# Altium schematic sheet SIM_slots_2.SchDoc
size A3; SheetNumber: 1; SheetTotal: 2
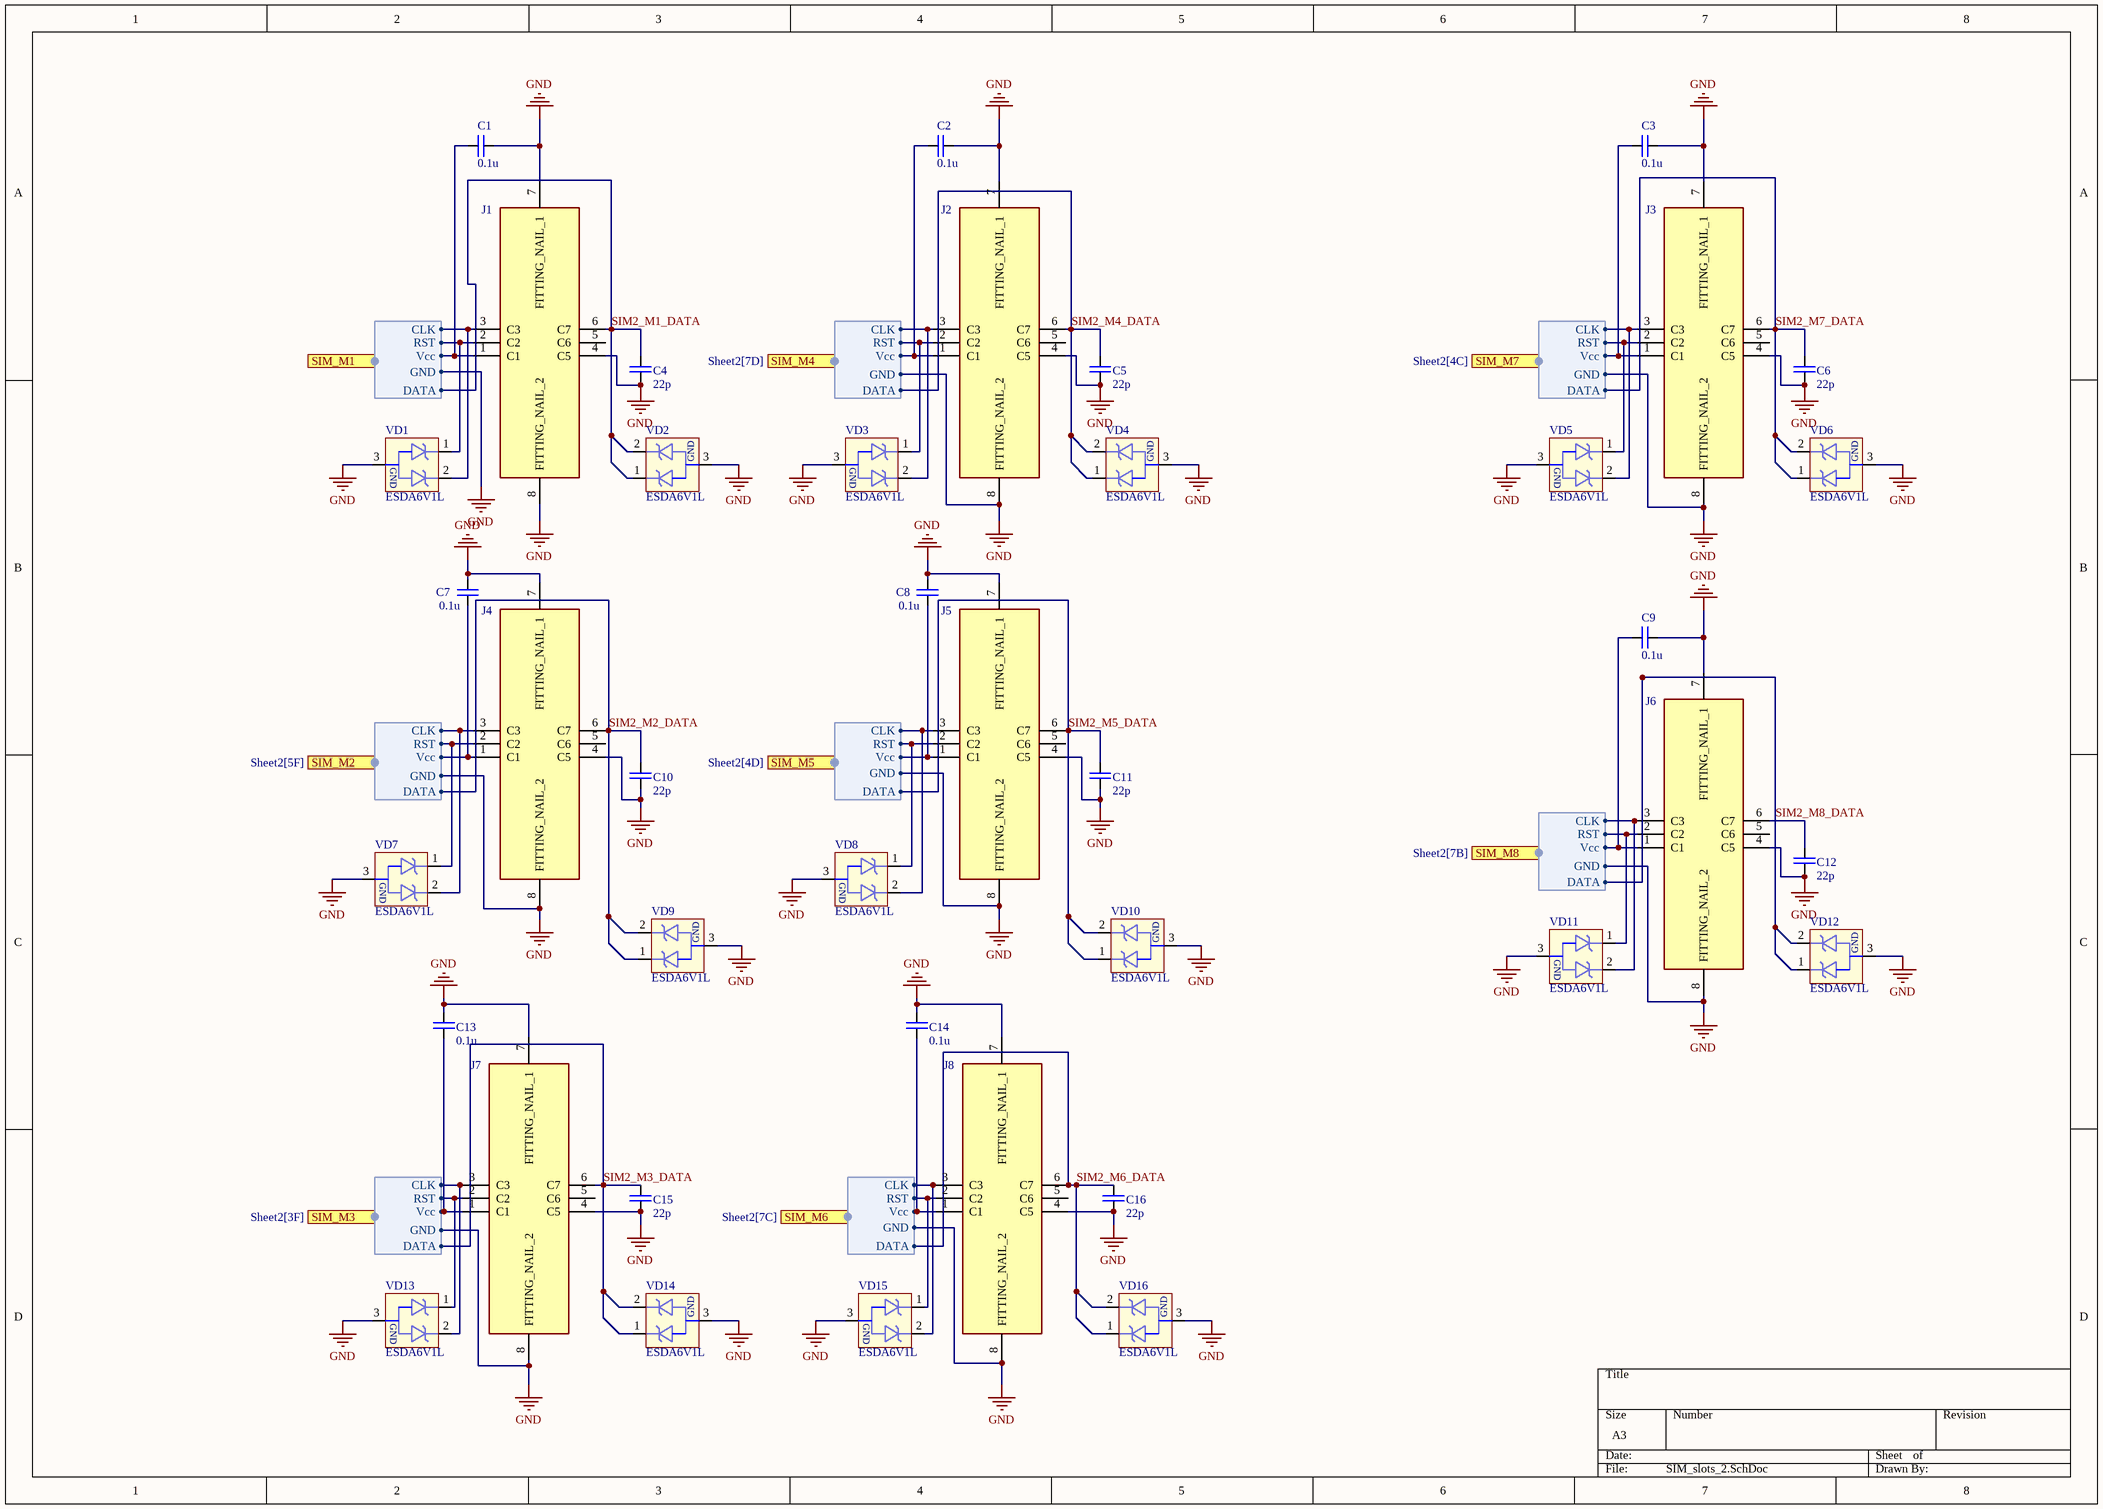
[diagram p0: SIM_slots_2.SchDoc]

## Parts
C1  value 0.1u  [C0402]  (hidden comment: Конденсатор SMD, 0.1мкФ, X7R, 25В, 10%, 0402)
C2  value 0.1u  [C0402]  (hidden comment: Конденсатор SMD, 0.1мкФ, X7R, 25В, 10%, 0402)
C3  value 0.1u  [C0402]  (hidden comment: Конденсатор SMD, 0.1мкФ, X7R, 25В, 10%, 0402)
C4  value 22p  [C0402]  (hidden comment: Конденсатор SMD, 22пФ, X7R, 50В, 10%, 0402)
C5  value 22p  [C0402]  (hidden comment: Конденсатор SMD, 22пФ, X7R, 50В, 10%, 0402)
C6  value 22p  [C0402]  (hidden comment: Конденсатор SMD, 22пФ, X7R, 50В, 10%, 0402)
C7  value 0.1u  [C0402]  (hidden comment: Конденсатор SMD, 0.1мкФ, X7R, 25В, 10%, 0402)
C8  value 0.1u  [C0402]  (hidden comment: Конденсатор SMD, 0.1мкФ, X7R, 25В, 10%, 0402)
C9  value 0.1u  [C0402]  (hidden comment: Конденсатор SMD, 0.1мкФ, X7R, 25В, 10%, 0402)
C10  value 22p  [C0402]  (hidden comment: Конденсатор SMD, 22пФ, X7R, 50В, 10%, 0402)
C11  value 22p  [C0402]  (hidden comment: Конденсатор SMD, 22пФ, X7R, 50В, 10%, 0402)
C12  value 22p  [C0402]  (hidden comment: Конденсатор SMD, 22пФ, X7R, 50В, 10%, 0402)
C13  value 0.1u  [C0402]  (hidden comment: Конденсатор SMD, 0.1мкФ, X7R, 25В, 10%, 0402)
C14  value 0.1u  [C0402]  (hidden comment: Конденсатор SMD, 0.1мкФ, X7R, 25В, 10%, 0402)
C15  value 22p  [C0402]  (hidden comment: Конденсатор SMD, 22пФ, X7R, 50В, 10%, 0402)
C16  value 22p  [C0402]  (hidden comment: Конденсатор SMD, 22пФ, X7R, 50В, 10%, 0402)
J1  47388-2001  [473882001]  (value not drawn)
J2  47388-2001  [473882001]  (value not drawn)
J3  47388-2001  [473882001]  (value not drawn)
J4  47388-2001  [473882001]  (value not drawn)
J5  47388-2001  [473882001]  (value not drawn)
J6  47388-2001  [473882001]  (value not drawn)
J7  47388-2001  [473882001]  (value not drawn)
J8  47388-2001  [473882001]  (value not drawn)
VD1  Диод защитный, ESDA6V1L  [SOT23-3L]  (value not drawn)
VD2  Диод защитный, ESDA6V1L  [SOT23-3L]  (value not drawn)
VD3  Диод защитный, ESDA6V1L  [SOT23-3L]  (value not drawn)
VD4  Диод защитный, ESDA6V1L  [SOT23-3L]  (value not drawn)
VD5  Диод защитный, ESDA6V1L  [SOT23-3L]  (value not drawn)
VD6  Диод защитный, ESDA6V1L  [SOT23-3L]  (value not drawn)
VD7  Диод защитный, ESDA6V1L  [SOT23-3L]  (value not drawn)
VD8  Диод защитный, ESDA6V1L  [SOT23-3L]  (value not drawn)
VD9  Диод защитный, ESDA6V1L  [SOT23-3L]  (value not drawn)
VD10  Диод защитный, ESDA6V1L  [SOT23-3L]  (value not drawn)
VD11  Диод защитный, ESDA6V1L  [SOT23-3L]  (value not drawn)
VD12  Диод защитный, ESDA6V1L  [SOT23-3L]  (value not drawn)
VD13  Диод защитный, ESDA6V1L  [SOT23-3L]  (value not drawn)
VD14  Диод защитный, ESDA6V1L  [SOT23-3L]  (value not drawn)
VD15  Диод защитный, ESDA6V1L  [SOT23-3L]  (value not drawn)
VD16  Диод защитный, ESDA6V1L  [SOT23-3L]  (value not drawn)

## Ports
SIM_M1 (harness SIM_m1, see Sheet2[7E]), SIM_M2 (harness SIM_2, see Sheet2[5F]), SIM_M3 (harness SIM_M3, see Sheet2[3F]), SIM_M4 (harness SIM_4, see Sheet2[7D]), SIM_M5 (harness SIM_5, see Sheet2[4D]), SIM_M6 (harness SIM_6, see Sheet2[7C]), SIM_M7 (harness SIM_M7, see Sheet2[4C]), SIM_M8 (harness SIM, see Sheet2[7B])

## Harnesses
SIM_m1: Vcc, RST, CLK, DATA, GND
SIM_2: Vcc, RST, CLK, DATA, GND
SIM_M3: Vcc, RST, CLK, DATA, GND
SIM_4: Vcc, RST, CLK, DATA, GND
SIM_5: Vcc, RST, CLK, DATA, GND
SIM_6: Vcc, RST, CLK, DATA, GND
SIM_M7: Vcc, RST, CLK, DATA, GND
SIM: Vcc, RST, CLK, DATA, GND

## Nets
GND: C1.2 C2.2 C3.2 C4.1 C5.1 C6.1 C7.2 C8.2 C9.2 C10.1 C11.1 C12.1 C13.2 C14.2 C15.1 C16.1 J1.4(C5) J1.7(FITTING_NAIL_1) J1.8(FITTING_NAIL_2) J2.4(C5) J2.7(FITTING_NAIL_1) J2.8(FITTING_NAIL_2) J3.4(C5) J3.7(FITTING_NAIL_1) J3.8(FITTING_NAIL_2) J4.4(C5) J4.7(FITTING_NAIL_1) J4.8(FITTING_NAIL_2) J5.4(C5) J5.7(FITTING_NAIL_1) J5.8(FITTING_NAIL_2) J6.4(C5) J6.7(FITTING_NAIL_1) J6.8(FITTING_NAIL_2) J7.4(C5) J7.7(FITTING_NAIL_1) J7.8(FITTING_NAIL_2) J8.4(C5) J8.7(FITTING_NAIL_1) J8.8(FITTING_NAIL_2) VD1.3(GND) VD2.3(GND) VD3.3(GND) VD4.3(GND) VD5.3(GND) VD6.3(GND) VD7.3(GND) VD8.3(GND) VD9.3(GND) VD10.3(GND) VD11.3(GND) VD12.3(GND) VD13.3(GND) VD14.3(GND) VD15.3(GND) VD16.3(GND) ; port SIM_M1.GND, port SIM_M2.GND, port SIM_M3.GND, port SIM_M4.GND, port SIM_M5.GND, port SIM_M6.GND, port SIM_M7.GND, port SIM_M8.GND
SIM2_M1_DATA: C4.2 J1.6(C7) VD2.1 VD2.2 ; port SIM_M1.DATA
SIM2_M2_DATA: C10.2 J4.6(C7) VD9.1 VD9.2 ; port SIM_M2.DATA
SIM2_M3_DATA: C15.2 J7.6(C7) VD14.1 VD14.2 ; port SIM_M3.DATA
SIM2_M4_DATA: C5.2 J2.6(C7) VD4.1 VD4.2 ; port SIM_M4.DATA
SIM2_M5_DATA: C11.2 J5.6(C7) VD10.1 VD10.2 ; port SIM_M5.DATA
SIM2_M6_DATA: C16.2 J8.6(C7) VD16.1 VD16.2 ; port SIM_M6.DATA
SIM2_M7_DATA: C6.2 J3.6(C7) VD6.1 VD6.2 ; port SIM_M7.DATA
SIM2_M8_DATA: C12.2 J6.6(C7) VD12.1 VD12.2 ; port SIM_M8.DATA
NetC1_1: C1.1 J1.1(C1) ; port SIM_M1.Vcc
NetC2_1: C2.1 J2.1(C1) ; port SIM_M4.Vcc
NetC3_1: C3.1 J3.1(C1) ; port SIM_M7.Vcc
NetC7_1: C7.1 J4.1(C1) ; port SIM_M2.Vcc
NetC8_1: C8.1 J5.1(C1) ; port SIM_M5.Vcc
NetC9_1: C9.1 J6.1(C1) ; port SIM_M8.Vcc
NetC13_1: C13.1 J7.1(C1) ; port SIM_M3.Vcc
NetC14_1: C14.1 J8.1(C1) ; port SIM_M6.Vcc
NetJ1_2: J1.2(C2) VD1.1 ; port SIM_M1.RST
NetJ1_3: J1.3(C3) VD1.2 ; port SIM_M1.CLK
NetJ2_2: J2.2(C2) VD3.1 ; port SIM_M4.RST
NetJ2_3: J2.3(C3) VD3.2 ; port SIM_M4.CLK
NetJ3_2: J3.2(C2) VD5.1 ; port SIM_M7.RST
NetJ3_3: J3.3(C3) VD5.2 ; port SIM_M7.CLK
NetJ4_2: J4.2(C2) VD7.1 ; port SIM_M2.RST
NetJ4_3: J4.3(C3) VD7.2 ; port SIM_M2.CLK
NetJ5_2: J5.2(C2) VD8.1 ; port SIM_M5.RST
NetJ5_3: J5.3(C3) VD8.2 ; port SIM_M5.CLK
NetJ6_2: J6.2(C2) VD11.1 ; port SIM_M8.RST
NetJ6_3: J6.3(C3) VD11.2 ; port SIM_M8.CLK
NetJ7_2: J7.2(C2) VD13.1 ; port SIM_M3.RST
NetJ7_3: J7.3(C3) VD13.2 ; port SIM_M3.CLK
NetJ8_2: J8.2(C2) VD15.1 ; port SIM_M6.RST
NetJ8_3: J8.3(C3) VD15.2 ; port SIM_M6.CLK

Not connected (* = marked no-connect by the designer): J1 5(C6); J2 5(C6); J3 5(C6); J4 5(C6); J5 5(C6); J6 5(C6); J7 5(C6); J8 5(C6)

## Library data of the parts
C1-C3 C7-C9 C13 C14 = C0402: Chip Capacitor 0402; Assembly: 0.1u_X7R_25V_10%_0402; Voltage_assembly: 25V; Tolerance: 10%; Voltage: 25В; TemperatureCoeff: X7R; Family: Конденсатор SMD; Capacitance: 0.1мкФ; Package: 0402
C4-C6 C10-C12 C15 C16 = C0402: Chip Capacitor 0402; Assembly: 22p_X7R_50V_10%_0402; Voltage_assembly: 50V; Tolerance: 10%; Voltage: 50В; TemperatureCoeff: X7R; Family: Конденсатор SMD; Capacitance: 22пФ; Package: 0402
J1-J8 = 47388-2001: Connector; Manufacturer_Name: Molex; Datasheet Link: https://www.molex.com/webdocs/datasheets/pdf/en-us/0473882001_MEMORY_CARD_SOCKET.pdf; Height: 1mm; Manufacturer_Part_Number: 47388-2001; Arrow Part Number: 47388-2001; Arrow Price/Stock: https://www.arrow.com/en/products/47388-2001/molex; Mouser Part Number: 538-47388-2001; Mouser Price/Stock: https://www.mouser.co.uk/ProductDetail/Molex/47388-2001?qs=KKUMDL8WE1K2q3cPEOwmLw%3D%3D
VD1-VD16 = ESDA6V1L: Dual diode array for ESD protection; Manufacturer: STMicroelectronics; Family: Диод защитный; Package: SOT23; Assembly: ESDA6V1L; PartNumber: ESDA6V1L